# EAGLE design board (EAGLE 9.5.1)
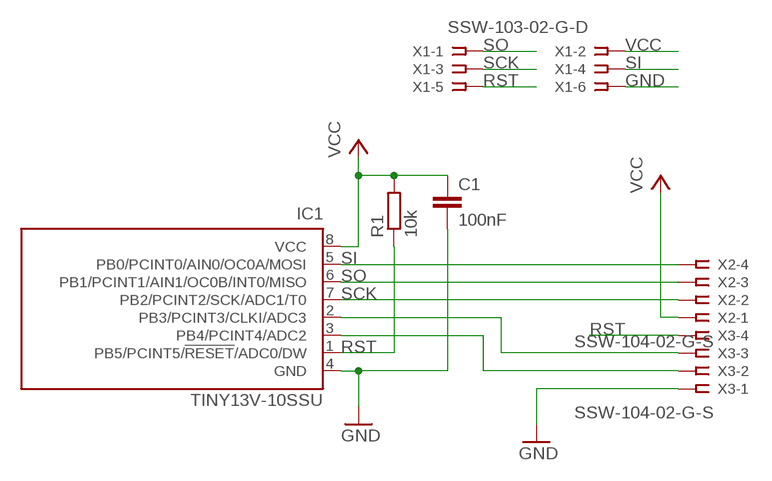
[diagram p0: schematic, sheet 1]

## Parts
C1  100nF  C-EUC1206K  [C1206K]
IC1  TINY13V-10SSU  [8S1]
R1  10k  R-EU_R1206  [R1206]
X1  SSW-103-02-G-D  [SSW-103-02-G-D]
X2  SSW-104-02-G-S  [SSW-104-02-G-S]
X3  SSW-104-02-G-S  [SSW-104-02-G-S]

## Nets
GND: C1.2 IC1.4(GND) X1.6 X3.1
N$1: IC1.3(PB4/PCINT4/ADC2) X3.2
N$2: IC1.2(PB3/PCINT3/CLKI/ADC3) X3.3
RST: IC1.1(PB5/PCINT5/!RESET!/ADC0/DW) R1.1 X1.5 X3.4
SCK: IC1.7(PB2/PCINT2/SCK/ADC1/T0) X1.3 X2.2
SI: IC1.5(PB0/PCINT0/AIN0/OC0A/MOSI) X1.4 X2.4
SO: IC1.6(PB1/PCINT1/AIN1/OC0B/INT0/MISO) X1.1 X2.3
VCC: C1.1 IC1.8(VCC) R1.2 X1.2 X2.1

## Library data of the parts
C1 = resistor:C-EU: CAPACITOR, European symbol
IC1 = atmel:TINY13: 8-bit AVR Microcontroller with 1K Bytes In-System Programmable Flash Source: http://www.atmel.com/dyn/resources/prod_documents/2535S.pdf; MPN: ATTINY13V-10SSU; OC_FARNELL: 1455135; OC_NEWARK: 58M3773
R1 = rcl:R-EU_: RESISTOR, European symbol; SPICEPREFIX: R
X1 = con-samtec:SSW-103-02-G: THROUGH-HOLE .025" SQ POST SOCKET Source: Samtec SSW.pdf; MF: Samtec Inc.; MPN: SSW-103-02-G-D; OC_FARNELL: unknown; OC_NEWARK: 11P9365
X2 X3 = con-samtec:SSW-104-02-G-S: THROUGH-HOLE .025" SQ POST SOCKET Source: Samtec SSW.pdf; MF: Samtec Inc.; MPN: SSW-104-02-G-S; OC_FARNELL: unknown; OC_NEWARK: 11P9384

## Board
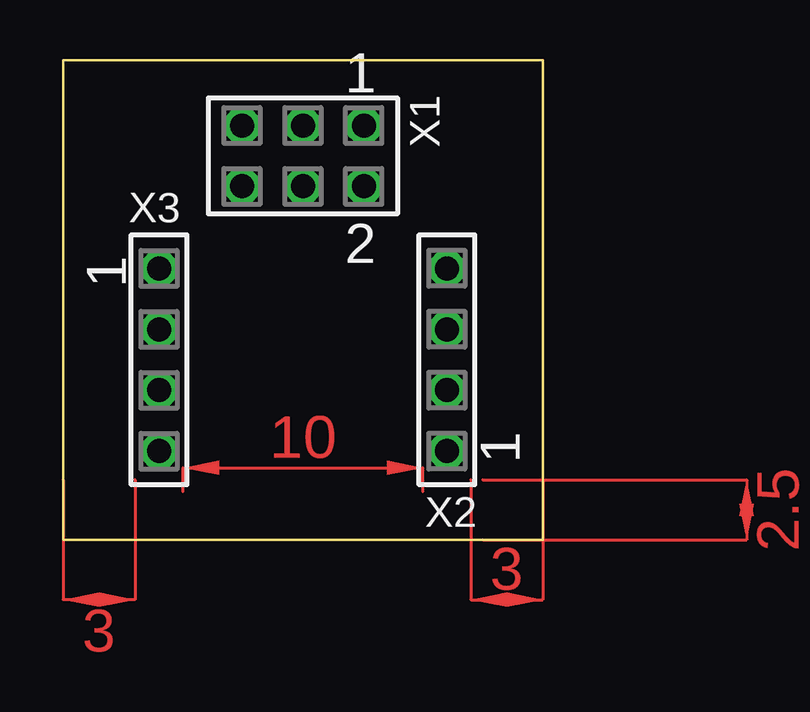
[diagram p1: board, top side]
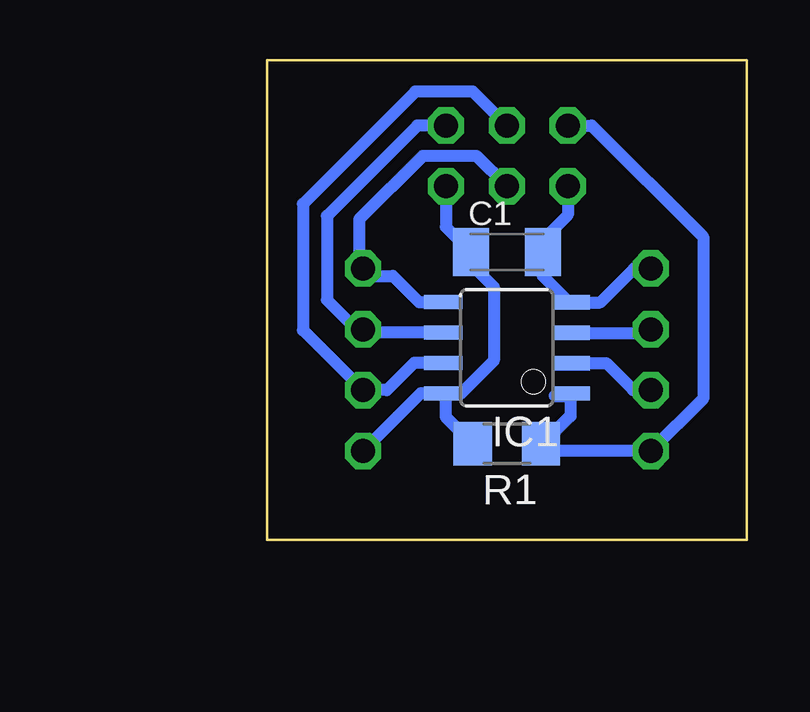
[diagram p2: board, bottom side, seen from below]

Size 20 x 20 mm. Coordinates in mm from the lower left corner, seen from the top.
Outline: 0,20 20,20 20,0 0,0 0,20
Copper layers (1*16): Top 0.035mm / dielectric 1.5mm / Bottom 0.035mm
Design rules "default *": minimum track width 0.5mm, minimum drill 0.35mm, track to track 0.2mm, track to pad 0.2mm, pad to pad 0.2mm, via to via 0.2mm, smd to smd 6mil, copper to edge 40mil, drill to drill 6mil, minimum pad ring 10mil, minimum via ring 8mil, stop-mask expansion 4mil, vias tented up to drill 0mil, thermal gap 10mil

### Footprints (pad centres in the part's own frame; a part is rotated, then mirrored left to right if it is on the bottom)
C1206K = smd 1.5 x 2: 1 -1.5,0; 2 1.5,0
8S1 = smd 0.6 x 1.6: 1 -1.905,-2.654; 2 -0.645,-2.654; 3 0.625,-2.654; 4 1.895,-2.654; 5 1.905,2.654; 6 0.635,2.654; 7 -0.635,2.654; 8 -1.905,2.654
R1206 = smd 1.6 x 1.803: 1 -1.422,0; 2 1.422,0
SSW-103-02-G-D = drill 1 pad 1.5 octagon: 1 -2.54,-1.27; 2 -2.54,1.27; 3 0,-1.27; 4 0,1.27; 5 2.54,-1.27; 6 2.54,1.27
SSW-104-02-G-S = drill 1 pad 1.5 octagon: 1 -3.81,0; 2 -1.27,0; 3 1.27,0; 4 3.81,0

### Placement (x,y rotation side)
C1  10,12 0 bottom
IC1  10,8 90 bottom
R1  10,4 180 bottom
X1  10,16 180 top
X2  16,7.5 90 top
X3  4,7.5 270 top

### Tracks (layer width: path | path; a pad name or v marks a point on that pad's centre or on a via)
GND
  Bottom 0.5: C1.2 8.5,12.5 7.46,13.54 X1.6 | 8.61,11.89 C1.2 | C1.2 8.5,11 7.39,9.89 IC1.4 6.11,9.89 4.69,11.31 X3.1
N$1
  Bottom 0.5: IC1.3 4.14,8.62 X3.2
N$2
  Bottom 0.5: IC1.2 5.86,7.36 4.73,6.23 X3.3
RST
  Bottom 0.5: 8,6 7.44,6 IC1.1 7.35,5.15 8.5,4 | X1.5 6.46,17.27 1.82,12.63 1.82,5.87 X3.4 8.19,3.69 8.5,4 | R1.1 8.5,4
SCK
  Bottom 0.5: X1.3 11.41,18.68 13.82,18.68 18.5,14 18.5,8.73 X2.2 15,6.23 13.86,7.36 IC1.7
SI
  Bottom 0.5: X1.4 11.27,16 13.5,16 16.15,13.35 16.15,11.46 X2.4 15.69,11 14.75,11 13.65,9.91 IC1.5
SO
  Bottom 0.5: X1.1 13.73,17.27 17.5,13.5 17.5,10 16.5,9 16.23,9 X2.3 16,8.64 IC1.6 13.14,8.64
VCC
  Bottom 0.5: IC1.8 13.15,6.09 | X1.2 12.54,13.04 C1.1 11.5,11.5 10.54,10.54 10.54,7.46 11.91,6.09 IC1.8 | IC1.8 12.54,5.98 12.54,5.12 R1.2 | IC1.8 13.59,6.09 X2.1
(copper drawn outside any net)
  shapes: Top area x4